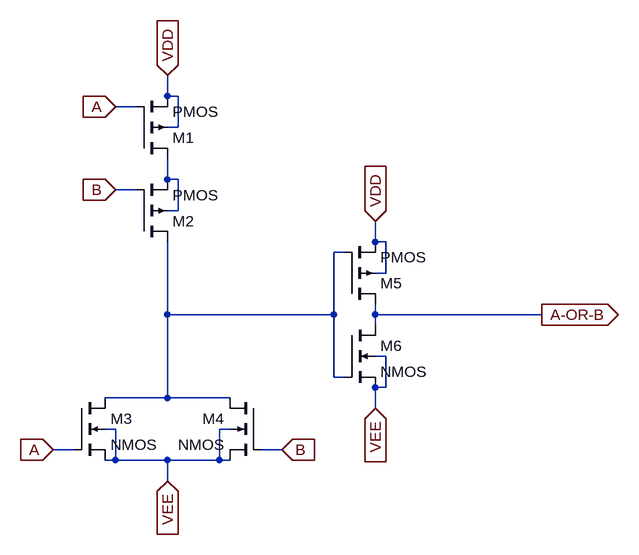
[diagram p0: schematic 2_Input_OR_Gate_Symbol.asc]
2_Input_OR_Gate_Symbol.asc, the LTspice schematic file:
Version 4
SHEET 1 1612 1096
WIRE 912 416 912 384
WIRE 928 416 912 416
WIRE 864 432 832 432
WIRE 928 464 928 416
WIRE 928 464 912 464
WIRE 912 544 912 512
WIRE 928 544 912 544
WIRE 864 560 832 560
WIRE 928 592 928 544
WIRE 928 592 912 592
WIRE 1232 640 1232 608
WIRE 1248 640 1232 640
WIRE 1184 656 1168 656
WIRE 1248 688 1248 640
WIRE 1248 688 1232 688
WIRE 912 752 912 640
WIRE 1168 752 1168 656
WIRE 1168 752 912 752
WIRE 1232 752 1232 736
WIRE 1488 752 1232 752
WIRE 1232 768 1232 752
WIRE 1248 816 1232 816
WIRE 1168 848 1168 752
WIRE 1184 848 1168 848
WIRE 1248 864 1248 816
WIRE 1248 864 1232 864
WIRE 912 880 912 752
WIRE 912 880 816 880
WIRE 1008 880 912 880
WIRE 1232 896 1232 864
WIRE 832 928 816 928
WIRE 1008 928 992 928
WIRE 768 960 736 960
WIRE 1088 960 1056 960
WIRE 832 976 832 928
WIRE 832 976 816 976
WIRE 912 976 832 976
WIRE 992 976 992 928
WIRE 992 976 912 976
WIRE 1008 976 992 976
WIRE 912 1008 912 976
FLAG 912 384 VDD
IOPIN 912 384 In
FLAG 912 1008 VEE
IOPIN 912 1008 In
FLAG 1232 896 VEE
IOPIN 1232 896 In
FLAG 1232 608 VDD
IOPIN 1232 608 In
FLAG 1488 752 A-OR-B
IOPIN 1488 752 Out
FLAG 832 432 A
IOPIN 832 432 In
FLAG 736 960 A
IOPIN 736 960 In
FLAG 1088 960 B
IOPIN 1088 960 In
FLAG 832 560 B
IOPIN 832 560 In
SYMBOL pmos4 864 512 M180
SYMATTR InstName M1
SYMBOL pmos4 864 640 M180
SYMATTR InstName M2
SYMBOL nmos4 768 880 R0
SYMATTR InstName M3
SYMBOL nmos4 1056 880 M0
SYMATTR InstName M4
SYMBOL pmos4 1184 736 M180
SYMATTR InstName M5
SYMBOL nmos4 1184 768 R0
SYMATTR InstName M6

The netlist it stands for:
* 2_Input_OR_Gate_Symbol.asc
M1 N001 A VDD VDD PMOS
M2 N002 B N001 N001 PMOS
M3 N002 A VEE VEE NMOS
M4 N002 B VEE VEE NMOS
M5 A-OR-B N002 VDD VDD PMOS
M6 A-OR-B N002 VEE VEE NMOS
.model NMOS NMOS
.model PMOS PMOS
.lib standard.mos
.backanno
.end